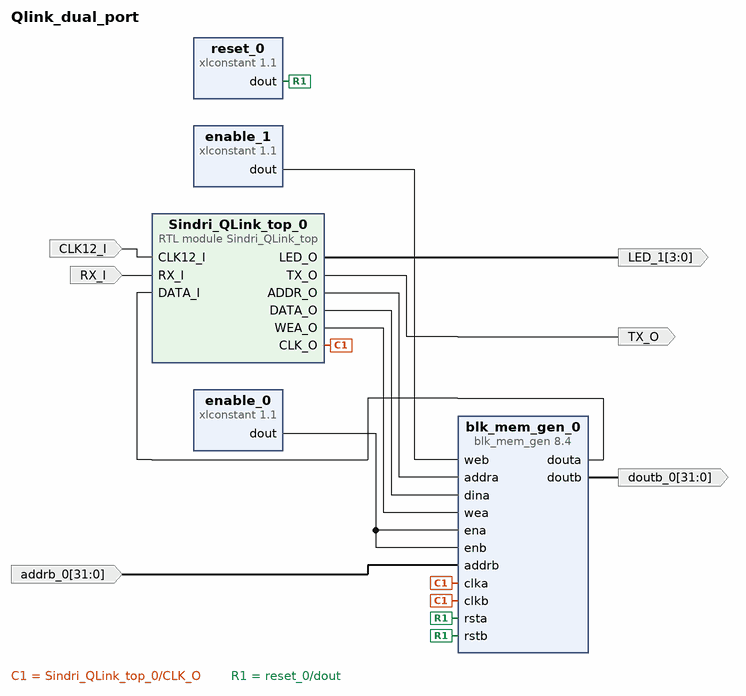
[diagram p0: block diagram of the top level]
# Vivado block design Qlink_dual_port, xc7s15ftgb196-1, Vivado 2025.2
create_bd_design Qlink_dual_port

create_bd_port -dir I CLK12_I
create_bd_port -dir O -from 3 -to 0 LED_1
create_bd_port -dir I RX_I
create_bd_port -dir O TX_O
create_bd_port -dir I -from 31 -to 0 addrb_0
create_bd_port -dir O -from 31 -to 0 doutb_0

create_bd_cell -type module -reference Sindri_QLink_top Sindri_QLink_top_0
create_bd_cell -type ip -vlnv xilinx.com:ip:blk_mem_gen:8.4 blk_mem_gen_0
set_property -dict {CONFIG.Memory_Type True_Dual_Port_RAM} [get_bd_cells blk_mem_gen_0]
create_bd_cell -type ip -vlnv xilinx.com:ip:xlconstant:1.1 enable_0
create_bd_cell -type ip -vlnv xilinx.com:ip:xlconstant:1.1 enable_1
set_property -dict {CONFIG.CONST_VAL 0000 CONFIG.CONST_WIDTH 4} [get_bd_cells enable_1]
create_bd_cell -type ip -vlnv xilinx.com:ip:xlconstant:1.1 reset_0
set_property -dict {CONFIG.CONST_VAL 0} [get_bd_cells reset_0]

# ---- connections ----

connect_bd_net [get_bd_ports CLK12_I] [get_bd_pins Sindri_QLink_top_0/CLK12_I]
connect_bd_net [get_bd_pins Sindri_QLink_top_0/ADDR_O] [get_bd_pins blk_mem_gen_0/addra]
connect_bd_net -net RX_I_0_1 [get_bd_ports RX_I] [get_bd_pins Sindri_QLink_top_0/RX_I]
connect_bd_net [get_bd_pins Sindri_QLink_top_0/CLK_O] [get_bd_pins blk_mem_gen_0/clka] [get_bd_pins blk_mem_gen_0/clkb]
connect_bd_net [get_bd_pins Sindri_QLink_top_0/DATA_O] [get_bd_pins blk_mem_gen_0/dina]
connect_bd_net [get_bd_pins Sindri_QLink_top_0/LED_O] [get_bd_ports LED_1]
connect_bd_net [get_bd_pins Sindri_QLink_top_0/TX_O] [get_bd_ports TX_O]
connect_bd_net [get_bd_pins Sindri_QLink_top_0/WEA_O] [get_bd_pins blk_mem_gen_0/wea]
connect_bd_net -net addrb_0_1 [get_bd_ports addrb_0] [get_bd_pins blk_mem_gen_0/addrb]
connect_bd_net [get_bd_pins blk_mem_gen_0/douta] [get_bd_pins Sindri_QLink_top_0/DATA_I]
connect_bd_net [get_bd_pins blk_mem_gen_0/doutb] [get_bd_ports doutb_0]
connect_bd_net -net enable_1_dout [get_bd_pins reset_0/dout] [get_bd_pins blk_mem_gen_0/rsta] [get_bd_pins blk_mem_gen_0/rstb]
connect_bd_net [get_bd_pins enable_1/dout] [get_bd_pins blk_mem_gen_0/web]
connect_bd_net -net xlconstant_0_dout [get_bd_pins enable_0/dout] [get_bd_pins blk_mem_gen_0/ena] [get_bd_pins blk_mem_gen_0/enb]

validate_bd_design
save_bd_design
